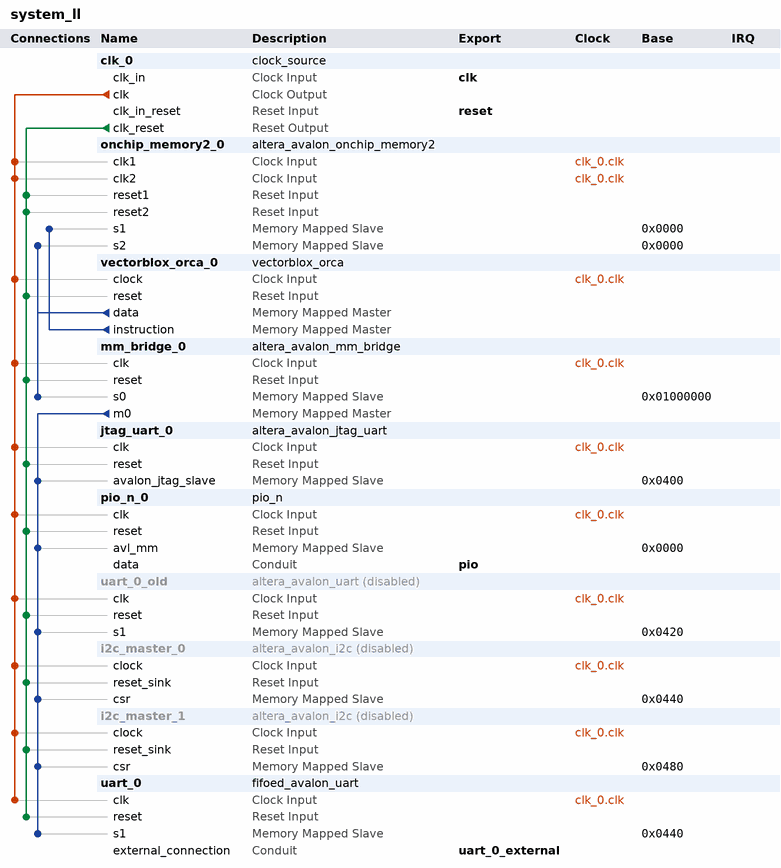
[diagram p0: system contents]
# Platform Designer (Qsys) system system_ll, Cyclone V 5CSEBA6U23I7
# Parameters at their usual value, and those the tool derives, are not listed.
package require -exact qsys 16.1
create_system system_ll
set_project_property DEVICE_FAMILY {Cyclone V}
set_project_property DEVICE 5CSEBA6U23I7

add_instance clk_0 clock_source 16.1
set_instance_parameter_value clk_0 clockFrequency 50000000

add_instance onchip_memory2_0 altera_avalon_onchip_memory2 16.1
set_instance_parameter_value onchip_memory2_0 dataWidth 32
set_instance_parameter_value onchip_memory2_0 dualPort true
set_instance_parameter_value onchip_memory2_0 initMemContent true
set_instance_parameter_value onchip_memory2_0 initializationFileName system_ll.hex
set_instance_parameter_value onchip_memory2_0 memorySize 32768
set_instance_parameter_value onchip_memory2_0 useNonDefaultInitFile true

add_instance vectorblox_orca_0 vectorblox_orca 1.0
set_instance_parameter_value vectorblox_orca_0 BRANCH_PREDICTION false
set_instance_parameter_value vectorblox_orca_0 BTB_SIZE 0
set_instance_parameter_value vectorblox_orca_0 BUS_TYPE Avalon
set_instance_parameter_value vectorblox_orca_0 COUNTER_LENGTH 64
set_instance_parameter_value vectorblox_orca_0 DIVIDE_ENABLE 1
set_instance_parameter_value vectorblox_orca_0 ENABLE_EXCEPTIONS 1
set_instance_parameter_value vectorblox_orca_0 EXT_INTERRUPTS 0
set_instance_parameter_value vectorblox_orca_0 LVE_ENABLE 0
set_instance_parameter_value vectorblox_orca_0 MULTIPLY_ENABLE 1
set_instance_parameter_value vectorblox_orca_0 PIPELINE_STAGES 4
set_instance_parameter_value vectorblox_orca_0 REGISTER_SIZE 32
set_instance_parameter_value vectorblox_orca_0 RESET_VECTOR 512
set_instance_parameter_value vectorblox_orca_0 SCRATCHPAD_SIZE 1024
set_instance_parameter_value vectorblox_orca_0 SHIFTER_MAX_CYCLES 1

add_instance mm_bridge_0 altera_avalon_mm_bridge 16.1
set_instance_parameter_value mm_bridge_0 ADDRESS_UNITS SYMBOLS
set_instance_parameter_value mm_bridge_0 ADDRESS_WIDTH 11
set_instance_parameter_value mm_bridge_0 DATA_WIDTH 32
set_instance_parameter_value mm_bridge_0 MAX_PENDING_RESPONSES 1
set_instance_parameter_value mm_bridge_0 PIPELINE_COMMAND 0
set_instance_parameter_value mm_bridge_0 PIPELINE_RESPONSE 0
set_instance_parameter_value mm_bridge_0 USE_AUTO_ADDRESS_WIDTH 1

add_instance jtag_uart_0 altera_avalon_jtag_uart 16.1
set_instance_parameter_value jtag_uart_0 readBufferDepth 8
set_instance_parameter_value jtag_uart_0 simInteractiveOptions NO_INTERACTIVE_WINDOWS

add_instance pio_n_0 pio_n 1.0
set_instance_parameter_value pio_n_0 ByteEnable false
set_instance_parameter_value pio_n_0 RegCnt 16

add_instance uart_0_old altera_avalon_uart 16.1
set_instance_property uart_0_old ENABLED false
set_instance_parameter_value uart_0_old baud 115200
set_instance_parameter_value uart_0_old dataBits 8
set_instance_parameter_value uart_0_old fixedBaud false
set_instance_parameter_value uart_0_old parity NONE
set_instance_parameter_value uart_0_old stopBits 1

add_instance i2c_master_0 altera_avalon_i2c 16.1
set_instance_property i2c_master_0 ENABLED false
set_instance_parameter_value i2c_master_0 FIFO_DEPTH 4

add_instance i2c_master_1 altera_avalon_i2c 16.1
set_instance_property i2c_master_1 ENABLED false
set_instance_parameter_value i2c_master_1 FIFO_DEPTH 4

add_instance uart_0 fifoed_avalon_uart 13.2
set_instance_parameter_value uart_0 add_error_bits false
set_instance_parameter_value uart_0 baud 115200
set_instance_parameter_value uart_0 dataBits 8
set_instance_parameter_value uart_0 driver_pass_error_bits false
set_instance_parameter_value uart_0 export_handshake false
set_instance_parameter_value uart_0 fifo_export_used false
set_instance_parameter_value uart_0 fifo_size_rx 8
set_instance_parameter_value uart_0 fifo_size_tx 8
set_instance_parameter_value uart_0 fixedBaud false
set_instance_parameter_value uart_0 gap_value 4
set_instance_parameter_value uart_0 hw_cts false
set_instance_parameter_value uart_0 parity NONE
set_instance_parameter_value uart_0 rx_IRQ_Threshold 1
set_instance_parameter_value uart_0 rx_fifo_LE false
set_instance_parameter_value uart_0 simInteractiveInputEnable false
set_instance_parameter_value uart_0 simInteractiveOutputEnable false
set_instance_parameter_value uart_0 simTrueBaud false
set_instance_parameter_value uart_0 stopBits 1
set_instance_parameter_value uart_0 syncRegDepth 2
set_instance_parameter_value uart_0 timeout_value 4
set_instance_parameter_value uart_0 timestamp_width 8
set_instance_parameter_value uart_0 trans_pin true
set_instance_parameter_value uart_0 tx_IRQ_Threshold 1
set_instance_parameter_value uart_0 tx_fifo_LE false
set_instance_parameter_value uart_0 useCtsRts false
set_instance_parameter_value uart_0 useEopRegister false
set_instance_parameter_value uart_0 useRelativePathForSimFile false
set_instance_parameter_value uart_0 use_ext_timestamp false
set_instance_parameter_value uart_0 use_gap_detection false
set_instance_parameter_value uart_0 use_rx_fifo false
set_instance_parameter_value uart_0 use_status_bit_clear false
set_instance_parameter_value uart_0 use_timestamp false
set_instance_parameter_value uart_0 use_timout false
set_instance_parameter_value uart_0 use_tx_fifo false

# connections
add_connection clk_0.clk i2c_master_0.clock clock
add_connection clk_0.clk i2c_master_1.clock clock
add_connection clk_0.clk jtag_uart_0.clk clock
add_connection clk_0.clk mm_bridge_0.clk clock
add_connection clk_0.clk onchip_memory2_0.clk1 clock
add_connection clk_0.clk onchip_memory2_0.clk2 clock
add_connection clk_0.clk pio_n_0.clk clock
add_connection clk_0.clk uart_0.clk clock
add_connection clk_0.clk uart_0_old.clk clock
add_connection clk_0.clk vectorblox_orca_0.clock clock
add_connection clk_0.clk_reset i2c_master_0.reset_sink reset
add_connection clk_0.clk_reset i2c_master_1.reset_sink reset
add_connection clk_0.clk_reset jtag_uart_0.reset reset
add_connection clk_0.clk_reset mm_bridge_0.reset reset
add_connection clk_0.clk_reset onchip_memory2_0.reset1 reset
add_connection clk_0.clk_reset onchip_memory2_0.reset2 reset
add_connection clk_0.clk_reset pio_n_0.reset reset
add_connection clk_0.clk_reset uart_0.reset reset
add_connection clk_0.clk_reset uart_0_old.reset reset
add_connection clk_0.clk_reset vectorblox_orca_0.reset reset
add_connection mm_bridge_0.m0 i2c_master_0.csr avalon
set_connection_parameter_value mm_bridge_0.m0/i2c_master_0.csr baseAddress 0x0440
add_connection mm_bridge_0.m0 i2c_master_1.csr avalon
set_connection_parameter_value mm_bridge_0.m0/i2c_master_1.csr baseAddress 0x0480
add_connection mm_bridge_0.m0 jtag_uart_0.avalon_jtag_slave avalon
set_connection_parameter_value mm_bridge_0.m0/jtag_uart_0.avalon_jtag_slave baseAddress 0x0400
add_connection mm_bridge_0.m0 pio_n_0.avl_mm avalon
set_connection_parameter_value mm_bridge_0.m0/pio_n_0.avl_mm baseAddress 0x0000
add_connection mm_bridge_0.m0 uart_0.s1 avalon
set_connection_parameter_value mm_bridge_0.m0/uart_0.s1 baseAddress 0x0440
add_connection mm_bridge_0.m0 uart_0_old.s1 avalon
set_connection_parameter_value mm_bridge_0.m0/uart_0_old.s1 baseAddress 0x0420
add_connection vectorblox_orca_0.data mm_bridge_0.s0 avalon
set_connection_parameter_value vectorblox_orca_0.data/mm_bridge_0.s0 baseAddress 0x01000000
add_connection vectorblox_orca_0.data onchip_memory2_0.s2 avalon
set_connection_parameter_value vectorblox_orca_0.data/onchip_memory2_0.s2 baseAddress 0x0000
add_connection vectorblox_orca_0.instruction onchip_memory2_0.s1 avalon
set_connection_parameter_value vectorblox_orca_0.instruction/onchip_memory2_0.s1 baseAddress 0x0000

# exported interfaces
add_interface clk clock sink
set_interface_property clk EXPORT_OF clk_0.clk_in
add_interface pio conduit end
set_interface_property pio EXPORT_OF pio_n_0.data
add_interface reset reset sink
set_interface_property reset EXPORT_OF clk_0.clk_in_reset
add_interface uart_0_external conduit end
set_interface_property uart_0_external EXPORT_OF uart_0.external_connection

set_interconnect_requirement {$system} qsys_mm.clockCrossingAdapter HANDSHAKE
set_interconnect_requirement {$system} qsys_mm.insertDefaultSlave FALSE
set_interconnect_requirement {$system} qsys_mm.maxAdditionalLatency 1

save_system system_ll.qsys
